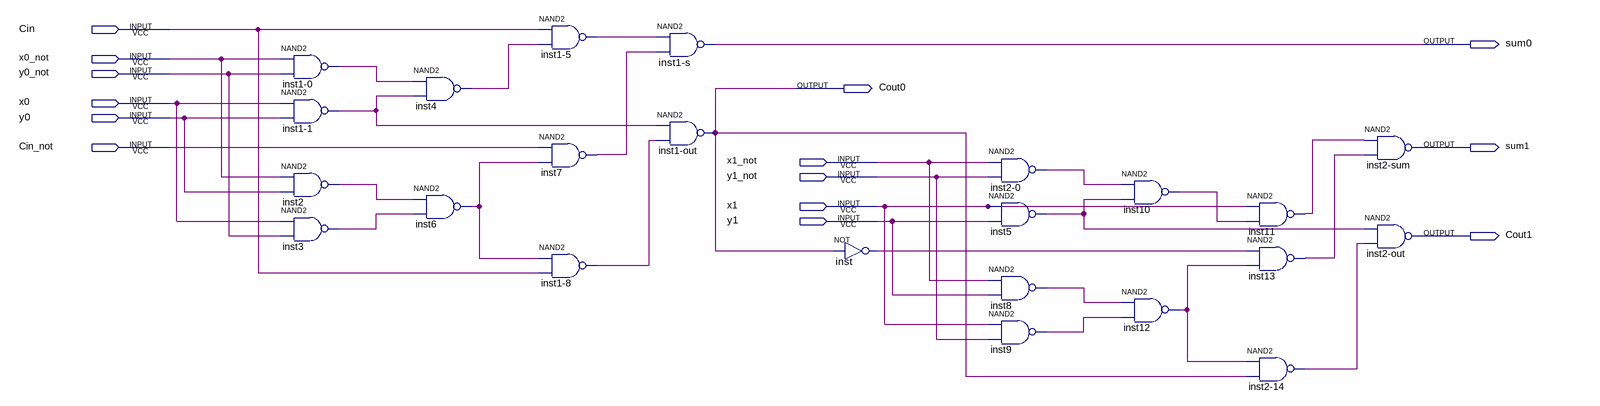
[diagram p0: schematic sheet]
// Quartus schematic Assignment.bdf as structural Verilog: 23 symbols, 14 pins
module Assignment (
  input  Cin,
  input  x0_not,
  input  y0_not,
  input  x0,
  input  y0,
  input  Cin_not,
  input  x1_not,
  input  y1_not,
  input  x1,
  input  y1,
  output sum0,
  output Cout0,
  output sum1,
  output Cout1
);

  wire inst1_0_out, inst1_1_out, inst1_5_out, inst1_8_out, inst2_0_out, inst2_14_out, inst2_out, inst3_out,
       inst4_out, inst5_out, inst6_out, inst7_out, inst8_out, inst9_out, inst10_out, inst11_out, inst12_out,
       inst13_out, inst_out;

  nand \inst1-0  (inst1_0_out, x0_not, y0_not);
  nand \inst1-1  (inst1_1_out, x0, y0);
  nand inst2 (inst2_out, x0_not, y0);
  nand inst3 (inst3_out, x0, y0_not);
  nand inst4 (inst4_out, inst1_0_out, inst1_1_out);
  nand inst6 (inst6_out, inst2_out, inst3_out);
  nand \inst1-5  (inst1_5_out, Cin, inst4_out);
  nand inst7 (inst7_out, Cin_not, inst6_out);
  nand \inst1-8  (inst1_8_out, inst6_out, Cin);
  nand \inst1-s  (sum0, inst1_5_out, inst7_out);
  nand \inst1-out  (Cout0, inst1_1_out, inst1_8_out);
  not inst (inst_out, Cout0);
  nand \inst2-0  (inst2_0_out, x1_not, y1_not);
  nand inst5 (inst5_out, x1, y1);
  nand inst8 (inst8_out, x1_not, y1);
  nand inst9 (inst9_out, x1, y1_not);
  nand inst10 (inst10_out, inst2_0_out, inst5_out);
  nand inst12 (inst12_out, inst8_out, inst9_out);
  nand inst11 (inst11_out, x1, inst10_out);
  nand inst13 (inst13_out, inst_out, inst12_out);
  nand \inst2-14  (inst2_14_out, inst12_out, Cout0);
  nand \inst2-sum  (sum1, inst11_out, inst13_out);
  nand \inst2-out  (Cout1, inst5_out, inst2_14_out);
endmodule
